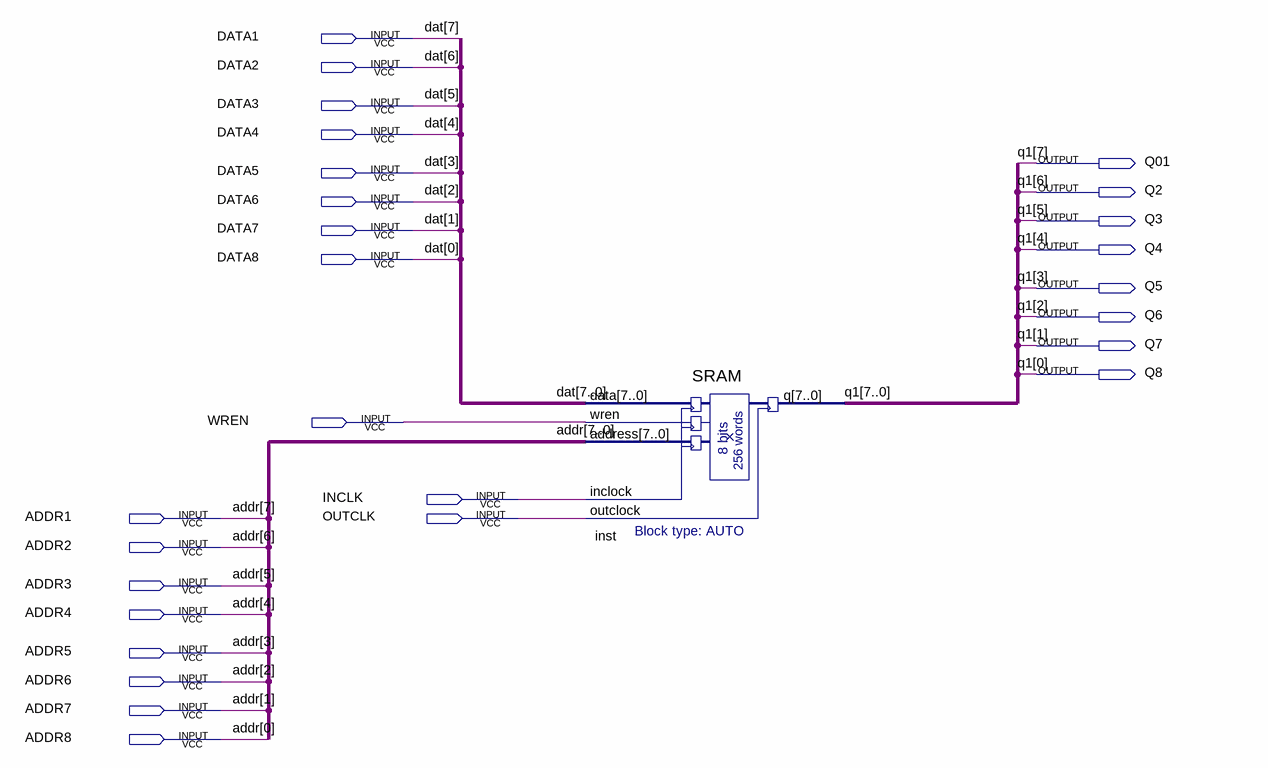
[diagram p0: schematic sheet]
// Quartus schematic MAIN.bdf as structural Verilog: 1 symbols, 27 pins
module MAIN (
  input  DATA1,
  input  DATA2,
  input  DATA3,
  input  DATA4,
  input  DATA5,
  input  DATA6,
  input  DATA7,
  input  DATA8,
  input  WREN,
  input  INCLK,
  input  ADDR1,
  input  OUTCLK,
  input  ADDR2,
  input  ADDR3,
  input  ADDR4,
  input  ADDR5,
  input  ADDR6,
  input  ADDR7,
  input  ADDR8,
  output Q01,
  output Q2,
  output Q3,
  output Q4,
  output Q5,
  output Q6,
  output Q7,
  output Q8
);

  SRAM inst (
    .data({DATA1, DATA2, DATA3, DATA4, DATA5, DATA6, DATA7, DATA8}), .wren(WREN),
    .address({ADDR1, ADDR2, ADDR3, ADDR4, ADDR5, ADDR6, ADDR7, ADDR8}), .inclock(INCLK), .outclock(OUTCLK),
    .q({Q01, Q2, Q3, Q4, Q5, Q6, Q7, Q8}));

  // Other names for the same wires on the sheet: addr (some bits) = {ADDR1, ADDR2, ADDR3, ADDR5, ADDR6, ADDR7, ADDR8};
  //   dat[7:0] = {DATA1, DATA2, DATA3, DATA4, DATA5, DATA6, DATA7, DATA8};
  //   q1[7:0] = {Q01, Q2, Q3, Q4, Q5, Q6, Q7, Q8}
endmodule
